# Altium schematic sheet voltage_regulation.SchDoc: Voltage Regulation
size A4; Author: Marcel Hellwig; Organization: Hamburg Bit-Bots; Address1: Vogt-Kölln-Str. 30; Address2: 22527 Hamburg; Address3: Germany; Address4: www.bit-bots.de; DocumentNumber: 4; SheetNumber: 4; SheetTotal: 4; EMail: info@bit-bots.de
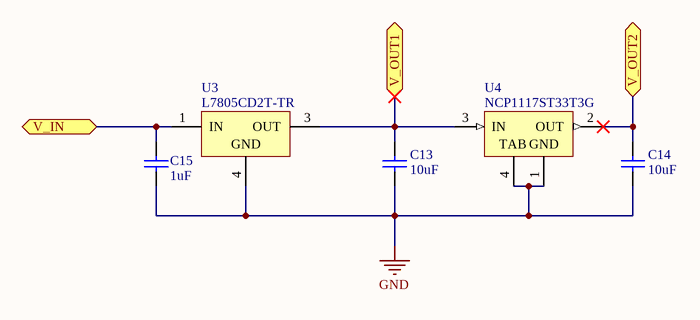
[diagram p0: voltage_regulation.SchDoc]

## Parts
C13  10uF  [C2012]
C14  10uF  [C2012]
C15  1uF  [C2012]
U3  L7805CD2T-TR  [TO-263_M]
U4  NCP1117ST33T3G  [ONSC-SOT-223_L]

## Ports
V_IN, V_OUT1, V_OUT2

## Nets
GND: C13.1 C14.1 C15.2 U3.4(GND) U4.1(GND) U4.4(TAB)
V_IN: C15.1 U3.1(IN) ; port V_IN
V_OUT1: C13.2 U3.3(OUT) U4.3(IN) ; port V_OUT1
V_OUT2: C14.2 U4.2(OUT) ; port V_OUT2

## Notes on the sheet
- Project:
- Author:
- Title:
- Rev:
- Date:
- Time:
- Sheet
- of

## Library data of the parts
C13 C14 = Cap: Capacitor; Manufacturer: MULTICOMP; Manufacturer Part Number: MC0805X106K250CT; Produktpalette: Baureihe MC; Kapazität: 10; Kapazitätstoleranz: ±10%; Dielektrikum: X5; Nennspannung: 25; Keramikkondensatorgehäuse: 0805 [Metrisch 2012]; Betriebstemperatur, min.: -55; Betriebstemperatur, max.: 85; Verpackung: Gurtabschnitt; Kondensatoranschlüsse: SMD<!--FANDB--><div class="features-and-benefits-container"></div>; Published: 8-Jun-2000; LatestRevisionDate: 17-Jul-2002; LatestRevisionNote: Re-released for DXP Platform.; PackageReference: RAD-0.3; Publisher: Altium Limited; PackageDescription: Radial Cap, Thru-Hole; 2 Leads; 0.3 in Pin Spacing; Value: 10uF; Supplier 1: Farnell; Supplier Part Number 1: 2320833; RoHS: YES; Stock 1: 46180; Pricing 1: 10=0,147, 100=0,121, 500=0,1, 1000=0,083, 1500=0,066 (EUR); MSL: MSL 1 - unbegrenzt; Bauform: 0805 [Metrisch 2012]; Kapazitätstoleranz ±: ±10%; ComponentLink1URL: http://www.farnell.com/datasheets/1870456.pdf; ComponentLink1Description: http://www.farnell.com/datasheets/1870456.pdf
C15 = Cap: Capacitor; Manufacturer: MULTICOMP; Manufacturer Part Number: MC0805B105K250CT; Produktpalette: Baureihe MC; Kapazität: 1; Kapazitätstoleranz: ±10%; Dielektrikum: X7; Nennspannung: 25; Keramikkondensatorgehäuse: 0805 [Metrisch 2012]; Betriebstemperatur, min.: -55; Betriebstemperatur, max.: 125; Verpackung: Gurtabschnitt; Kondensatoranschlüsse: SMD<!--FANDB--><div class="features-and-benefits-container"></div>; Published: 8-Jun-2000; LatestRevisionDate: 17-Jul-2002; LatestRevisionNote: Re-released for DXP Platform.; PackageReference: RAD-0.3; Publisher: Altium Limited; PackageDescription: Radial Cap, Thru-Hole; 2 Leads; 0.3 in Pin Spacing; Value: 1uF; Supplier 1: Farnell; Supplier Part Number 1: 2320827; RoHS: YES; Stock 1: 4031; Pricing 1: 10=0,06, 100=0,05, 500=0,041, 1000=0,034, 1500=0,027 (EUR); MSL: MSL 1 - unbegrenzt; Bauform: 0805 [Metrisch 2012]; Kapazitätstoleranz ±: ±10%; ComponentLink1URL: http://www.farnell.com/datasheets/1870456.pdf; ComponentLink1Description: http://www.farnell.com/datasheets/1870456.pdf
U3 = CMP-0244-00213-1: Positive Voltage Regulator, 3-Pin D2PAK, Tape and Reel; PackageReference: TO-263; ComponentLink2URL: http://www.st.com/internet/com/TECHNICAL_RESOURCES/TECHNICAL_LITERATURE/DATASHEET/CD00000444.pdf; PackageDescription: 3-Pin Transistor Outline Package 2.54 mm Pitch, 15.4 mm Lead Span (D2PAK); DatasheetVersion: 16/11/2011; ComponentLink2Description: Datasheet; ComponentLink1Description: Manufacturer URL; PackageVersion: 2011; ComponentLink1URL: http://www.st.com; Supplier 1: Farnell; Supplier Part Number 1: 1366576
U4 = CMP-0592-00001-2: 1.0 A Low-Dropout Positive Fixed Voltage Regulator, 5 V Vout, 0 to 125 degC, 4-Pin SOT-223, Pb-Free, Tape and Reel; PartNumber: NCP1117ST50T3G; Manufacturer: ON Semiconductor; IQ: 6 mA; Iout (Min): 1 A; Nominal Output Voltage: 3.3 V; Vin: 20 V; RR: 61 dB; Dropout Voltage: 1.2 V; Packing: Tape and Reel; DatasheetVersion: Rev. 26; ComponentLink3URL: http://www.onsemi.com/pub_link/Collateral/318H-01.PDF; ComponentLink2URL: http://www.onsemi.com/pub_link/Collateral/NCP1117-D.PDF; Mounting Technology: Surface Mount; ComponentLink2Description: Datasheet; Operating Temperature: 0 to 125 degC; ComponentLink1Description: Manufacturer URL; PackageDescription: 4-Pin Small Out-Line Transistor, Body 3.5 x 6.5 mm, Pitch 2.3 mm; ComponentLink1URL: http://www.onsemi.com/; PackageReference: SOT-223; ComponentLink3Description: Package Specification; Supplier 1: Farnell; Supplier Part Number 1: 1652366